# Altium schematic sheet Sheet3.SchDoc
size B; SheetNumber: 2; SheetTotal: 4
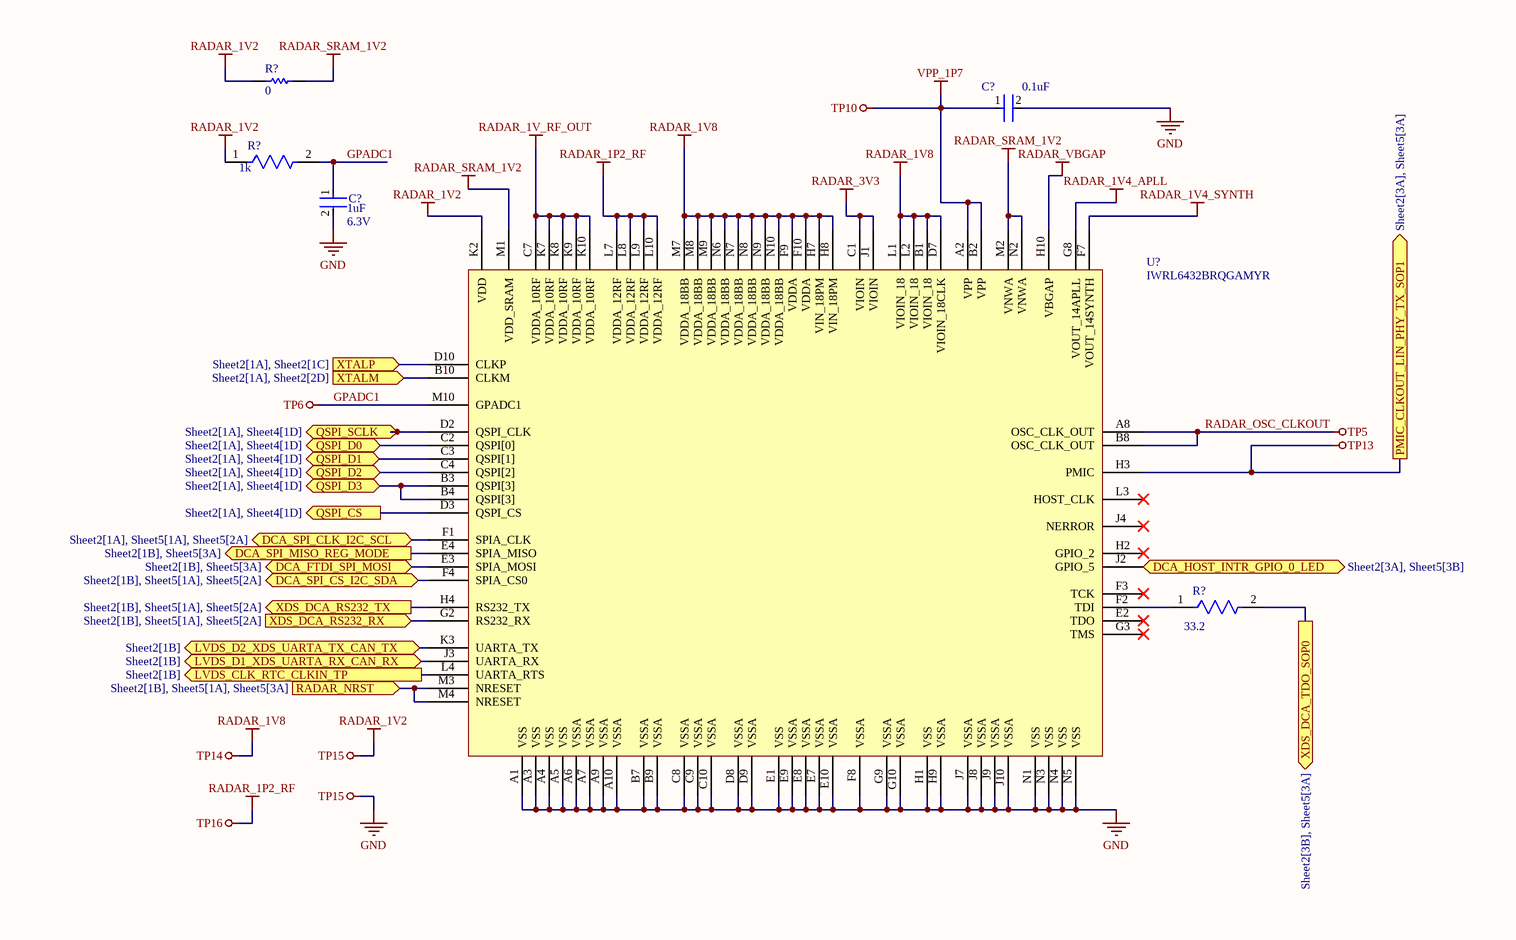
[diagram p0: Sheet3.SchDoc]

## Parts
(Parts that share a designator on the sheet are numbered #1, #2 ... from top to bottom, then left to right.)
C?#1  0.1uF  [FP-C0402-BB-MFG]
C?#2  Capacitance: 1uF  Voltage Rating (DC): 6.3V  [FP-GRM155-0_05-IPC_C]  (hidden comment: GRM155C81.uF0J105KA12D)
R?#1  0  [RESC1005X40X25LL05T05]
R?#2  1k  [FP-RC0402-0_4-IPC_A]
R?#3  Resistance: 33.2  [FP-RT0402-0_35-MFG]  (hidden comment: RT0402FRE0733R2L)
U?  IWRL6432BRQGAMYR

## Ports
DCA_FTDI_SPI_MOSI (bidir, see Sheet2[1B], Sheet5[3A]), DCA_HOST_INTR_GPIO_0_LED (bidir, see Sheet2[3A], Sheet5[3B]), DCA_SPI_CLK_I2C_SCL (bidir, see Sheet2[1A], Sheet5[1A], Sheet5[2A]), DCA_SPI_CS_I2C_SDA (bidir, see Sheet2[1B], Sheet5[1A], Sheet5[2A]), DCA_SPI_MISO_REG_MODE (out, see Sheet2[1B], Sheet5[3A]), LVDS_CLK_RTC_CLKIN_TP (out, see Sheet2[1B]), LVDS_D1_XDS_UARTA_RX_CAN_RX (bidir, see Sheet2[1B]), LVDS_D2_XDS_UARTA_TX_CAN_TX (bidir, see Sheet2[1B]), PMIC_CLKOUT_LIN_PHY_TX_SOP1 (out, see Sheet2[3A], Sheet5[3A]), QSPI_CS (out, see Sheet2[1A], Sheet4[1D]), QSPI_D0 (bidir, see Sheet2[1A], Sheet4[1D]), QSPI_D1 (bidir, see Sheet2[1A], Sheet4[1D]), QSPI_D2 (bidir, see Sheet2[1A], Sheet4[1D]), QSPI_D3 (bidir, see Sheet2[1A], Sheet4[1D]), QSPI_SCLK (bidir, see Sheet2[1A], Sheet4[1D]), RADAR_NRST (in, see Sheet2[1B], Sheet5[1A], Sheet5[3A]), XDS_DCA_RS232_RX (in, see Sheet2[1B], Sheet5[1A], Sheet5[2A]), XDS_DCA_RS232_TX (out, see Sheet2[1B], Sheet5[1A], Sheet5[2A]), XDS_DCA_TDO_SOP0 (out, see Sheet2[3B], Sheet5[3A]), XTALM (in, see Sheet2[1A], Sheet2[2D]), XTALP (in, see Sheet2[1A], Sheet2[1C])

## Nets
GND: C?#1.2 C?#2.2 R?#1.2 R?#2.1 U?.A1(VSS) U?.A3(VSS) U?.A4(VSS) U?.A5(VSS) U?.A6(VSSA) U?.A7(VSSA) U?.A9(VSSA) U?.A10(VSSA) U?.B7(VSSA) U?.B9(VSSA) U?.C8(VSSA) U?.C9(VSSA) U?.C10(VSSA) U?.D8(VSSA) U?.D9(VSSA) U?.E1(VSS) U?.E7(VSSA) U?.E8(VSSA) U?.E9(VSSA) U?.E10(VSSA) U?.F8(VSSA) U?.G9(VSSA) U?.G10(VSSA) U?.H1(VSS) U?.H9(VSSA) U?.J7(VSSA) U?.J8(VSSA) U?.J9(VSSA) U?.J10(VSSA) U?.K2(VDD) U?.N1(VSS) U?.N3(VSS) U?.N4(VSS) U?.N5(VSS)  [also labelled RADAR_1V2, TP15]
GPADC1: C?#2.1 R?#2.2 U?.M10(GPADC1)  [also labelled TP6]
RADAR_1P2_RF: U?.L7(VDDA_12RF) U?.L8(VDDA_12RF) U?.L9(VDDA_12RF) U?.L10(VDDA_12RF)  [also labelled TP16]
RADAR_1V4_APLL: U?.G8(VOUT_14APLL)
RADAR_1V4_SYNTH: U?.F7(VOUT_14SYNTH)
RADAR_1V8: U?.B1(VIOIN_18) U?.D7(VIOIN_18CLK) U?.F9(VDDA) U?.F10(VDDA) U?.H7(VIN_18PM) U?.H8(VIN_18PM) U?.L1(VIOIN_18) U?.L2(VIOIN_18) U?.M7(VDDA_18BB) U?.M8(VDDA_18BB) U?.M9(VDDA_18BB) U?.N6(VDDA_18BB) U?.N7(VDDA_18BB) U?.N8(VDDA_18BB) U?.N9(VDDA_18BB) U?.N10(VDDA_18BB)  [also labelled TP14]
RADAR_1V_RF_OUT: U?.C7(VDDA_10RF) U?.K7(VDDA_10RF) U?.K8(VDDA_10RF) U?.K9(VDDA_10RF) U?.K10(VDDA_10RF)
RADAR_3V3: U?.C1(VIOIN) U?.J1(VIOIN)
RADAR_OSC_CLKOUT: U?.A8(OSC_CLK_OUT) U?.B8(OSC_CLK_OUT)  [also labelled TP5]
RADAR_SRAM_1V2: R?#1.1 U?.M1(VDD_SRAM) U?.M2(VNWA) U?.N2(VNWA)
RADAR_VBGAP: U?.H10(VBGAP)
TP10: C?#1.1 U?.A2(VPP) U?.B2(VPP)  [also labelled VPP_1P7]
TP13: U?.H3(PMIC) ; port PMIC_CLKOUT_LIN_PHY_TX_SOP1
DCA_FTDI_SPI_MOSI: U?.E3(SPIA_MOSI) ; port DCA_FTDI_SPI_MOSI
DCA_HOST_INTR_GPIO_0_LED: U?.J2(GPIO_5) ; port DCA_HOST_INTR_GPIO_0_LED
DCA_SPI_CLK_I2C_SCL: U?.F1(SPIA_CLK) ; port DCA_SPI_CLK_I2C_SCL
DCA_SPI_CS_I2C_SDA: U?.F4(SPIA_CS0) ; port DCA_SPI_CS_I2C_SDA
DCA_SPI_MISO_REG_MODE: U?.E4(SPIA_MISO) ; port DCA_SPI_MISO_REG_MODE
LVDS_CLK_RTC_CLKIN_TP: U?.L4(UARTA_RTS) ; port LVDS_CLK_RTC_CLKIN_TP
LVDS_D1_XDS_UARTA_RX_CAN_RX: U?.J3(UARTA_RX) ; port LVDS_D1_XDS_UARTA_RX_CAN_RX
LVDS_D2_XDS_UARTA_TX_CAN_TX: U?.K3(UARTA_TX) ; port LVDS_D2_XDS_UARTA_TX_CAN_TX
QSPI_CS: U?.D3(QSPI_CS) ; port QSPI_CS
QSPI_D0: U?.C2(QSPI[0]) ; port QSPI_D0
QSPI_D1: U?.C3(QSPI[1]) ; port QSPI_D1
QSPI_D2: U?.C4(QSPI[2]) ; port QSPI_D2
QSPI_D3: U?.B3(QSPI[3]) U?.B4(QSPI[3]) ; port QSPI_D3
QSPI_SCLK: U?.D2(QSPI_CLK) ; port QSPI_SCLK
RADAR_NRST: U?.M3(NRESET) U?.M4(NRESET) ; port RADAR_NRST
XDS_DCA_RS232_RX: U?.G2(RS232_RX) ; port XDS_DCA_RS232_RX
XDS_DCA_RS232_TX: U?.H4(RS232_TX) ; port XDS_DCA_RS232_TX
XDS_DCA_TDO_SOP0: R?#3.2 ; port XDS_DCA_TDO_SOP0
XTALM: U?.B10(CLKM) ; port XTALM
XTALP: U?.D10(CLKP) ; port XTALP
NetR?#3_1: R?#3.1 U?.F2(TDI)

Not connected (* = marked no-connect by the designer): U? E2(TDO)* F3(TCK)* G3(TMS)* H2(GPIO_2)* J4(NERROR)* L3(HOST_CLK)*

## Library data of the parts
C?#1 = CMP-2008-03086-2: CAP CER 0.1UF 10V X7R 0402; Manufacturer Part Number: C0402C104K8RACTU; Manufacturer: Kemet; Capacitance: 0.10 μF; Tolerance: 0.1; Temperature Coefficient: 15%; Value: 0.10 μF; Material: Ceramic; Automotive: No; Temperature Range High: +125°C; Octopart: https://octopart.com/c0402c104k8ractu-kemet-106349; ComponentLink2Description: Datasheet; ComponentLink2URL: https://content.kemet.com/datasheets/KEM_C1002_X7R_SMD.pdf; Temperature: -55°C to +125°C; RoHS: TRUE; Temperature Range Low: -55°C; Temperature Characteristic: X7R; Lead Free: Yes; Height: 0.55mm; Voltage Rating: 10 V; Category: Cap; Device Class L3: Ceramic Capacitors; Digikey Description: CAP CER 0.1UF 10V X7R 0402; Package: C0402-BB; Device Class L1: Passive Components; Ipc Land Pattern Name: CAPC10050X50; Mouser Description: Multilayer Ceramic Capacitors MLCC - SMD/SMT 10volts 0.1uF X7R 10%; Device Class L2: Capacitors
C?#2 = CMP-06035-011876-1: Chip Multilayer Ceramic Capacitors for General Purpose, 0402, 1.0uF, X6S, 22%, 10%, 6.3V; Dielectric: X6S; Width: 500um; Length: 1mm; Thickness: 500um; Tolerance: 10%
R?#1 = CMP-2000-07451-1: Chip Resistor, 0 Ohm, 0.1 W, -55 to 155 degC, 0402 (1005 Metric), RoHS, Tape and Reel; Manufacturer: Panasonic; Voltage Rating (DC): 50V; Temperature Coefficient: 600ppm/��C; Max Power Dissipation: 100mW; Resistance: 0mOhm; Tolerance: 5%; Number of Terminations: 2; Mount: SurfaceMount; Height: 0.35mm; Packaging: TapeandReel; Contact Plating: Tin; Manufacturer URL: http://www.panasonic.com/; Composition: ThickFilm; Max Operating Temperature: 155degC; REACH SVHC: NoSVHC; Case/Package: 0402; Package Reference: 402; Depth: 0.5mm; Package Description: 2-Pin Surface Mount Device, Body 1 x 0.5 mm; Datasheet URL: https://industrial.panasonic.com/cdbs/www-data/pdf/RDA0000/AOA0000C301.pdf; RoHSCompliant: True; Case Code (Imperial): 0402; Military Standard: Not; Min Operating Temperature: -55degC; Power Rating: 100mW; Datasheet Version: 03/2015; Length: 1mm; Case Code (Metric): 1005; Termination: SMD/SMT; Mounting Technology: SurfaceMount; Voltage Rating: 50V; Width: 0.02inch; Package Quantity: 1; Lead Free: LeadFree; Radiation Hardening: No
R?#2 = CMP-2002-07472-3: RES 1K OHM 1% 1/16W 0402; Max Power Dissipation: 63mW; Resistance: 1kR; Voltage Rating (DC): 50V; Temperature Coefficient: 100ppm/°C; Power Rating: 62.5mW; Technology: THICK FILM; Size Code: 0402; Series: RC; Length: 1mm; Case/Package: 0402; Features: Moisture Resistant; Termination: SMD/SMT; Case Code (Metric): 1005; Reach SVHC Compliant: Yes; Number of Terminations: 2; Tolerance: 1%; Lead Free: Lead Free; Military Standard: Not; Resistor Type: Thick Film; Max Operating Temperature: 155°C; RoHS Compliant: Yes; Construction: Rectangular; Voltage Rating: 50V; Packaging: Tape and Reel; Height: 0.32mm; Number of Pins: 2; Resistance Tolerance: 1%; Case Code (Imperial): 0402; Depth: 0.5mm; Min Operating Temperature: -55°C; Width: 0.5mm
R?#3 = CMP-2002-03033-3: NexarPartId: 1272564; Max Power Dissipation: 63mW; Voltage Rating: 50V; Temperature Coefficient: 50ppm/°C; Tolerance: 1%; Packaging: Tape & Reel (TR); Radiation Hardening: No; Military Standard: Not; Contact Plating: Tin; Case Code (Metric): 0402; Max Operating Temperature: 125°C; Height: 350µm; Lead Free: Lead Free; Case/Package: 0402; Width: 508µm; Length: 990.6µm; RoHS: Compliant; Number of Terminations: 2; Voltage Rating (DC): 50V; Min Operating Temperature: -55°C; Power Rating: 63mW; Depth: 500µm; Composition: Thin Film
U? = IWRL6432BRQGAMYR: Single-chip low-power 57GHz to 63.5GHz industrial mmWave radar sensor with integrated antenna 101-FCCSP -40 to 105; Manufacturer: Texas Instruments; Manufacturer Lifecycle Status: ACTIVE; Supplier: DigiKey; RoHS: Compliant; Category: Integrated Circuits (ICs); Stock: 660; Pricing: 1=23.37, 10=18.741, 25=17.5856, 100=16.3158, 250=15.71048, 500=15.6646 (USD); Length: 6.7mm; Lifecycle Status: Production; Pins: 101; Thickness: 590µm; Width: 10.9mm; ComponentLink1URL: https://octopart.com:443/opatz8j6/c1?t=Egb_erevs3RStRjh2mlmCnEG9Uh47Pzg3cSpCtnXbFqH-EuG7b0UoPeMwzv6uml3GcXCdAAsWgk-ti-PfCW5k-M0woeo87gnP9JZvt22ZJaH3HWiyj9uubX5N1ltG3cc81QDNrGR6m7xBTt8HxFxUmaG27JTVwD44xpwsGUwPa1RG5SeOAXVQNSJaaLYmU8pO3s9gbtCZkK0ggLPM9_OGtQjvX1SpQi-vOEjoET3vtit91p9E2u7nVmS6IIobeqpa7zFUum8qgXNzRGCQjFKIlVvGfdPqF4FtUiICJ4fmOmq-n0S25o2RTTJy4D3bFrDr4sBQpjhQeg-2d-r6gztwI7SmI0itX5aV5v5A0SyZ9Q0W32DfAc2XU4pqv4lxGxCeXTcFphh-YAX&src-supplier=Texas+Instruments; ComponentLink1Description: https://octopart.com:443/opatz8j6/c1?t=Egb_erevs3RStRjh2mlmCnEG9Uh47Pzg3cSpCtnXbFqH-EuG7b0UoPeMwzv6uml3GcXCdAAsWgk-ti-PfCW5k-M0woeo87gnP9JZvt22ZJaH3HWiyj9uubX5N1ltG3cc81QDNrGR6m7xBTt8HxFxUmaG27JTVwD44xpwsGUwPa1RG5SeOAXVQNSJaaLYmU8pO3s9gbtCZkK0ggLPM9_OGtQjvX1SpQi-vOEjoET3vtit91p9E2u7nVmS6IIobeqpa7zFUum8qgXNzRGCQjFKIlVvGfdPqF4FtUiICJ4fmOmq-n0S25o2RTTJy4D3bFrDr4sBQpjhQeg-2d-r6gztwI7SmI0itX5aV5v5A0SyZ9Q0W32DfAc2XU4pqv4lxGxCeXTcFphh-YAX&src-supplier=Texas+Instruments; ComponentLink2URL: https://datasheet.octopart.com:443/IWRL6432BRQGAMYR-Texas-Instruments-datasheet-191815078.pdf?src-supplier=LCSC; ComponentLink2Description: https://datasheet.octopart.com:443/IWRL6432BRQGAMYR-Texas-Instruments-datasheet-191815078.pdf?src-supplier=LCSC; ComponentLink3URL: http://sigma.octopart.com:80/reach_statement/Texas-Instruments-company-64.pdf?src-supplier=Compliance+Statements; ComponentLink3Description: http://sigma.octopart.com:80/reach_statement/Texas-Instruments-company-64.pdf?src-supplier=Compliance+Statements; ComponentLink4URL: http://sigma.octopart.com:80/conflict_mineral_statement/Texas-Instruments-company-63.pdf?src-supplier=Compliance+Statements; ComponentLink4Description: http://sigma.octopart.com:80/conflict_mineral_statement/Texas-Instruments-company-63.pdf?src-supplier=Compliance+Statements; Supplier Part Number: 296-IWRL6432BRQGAMYRCT-ND; Manufacturer Part Number: IWRL6432BRQGAMYR